# Altium schematic sheet Peripheral-Section.SchDoc
size A4; DocumentNumber: 3; SheetNumber: 3; SheetTotal: 8
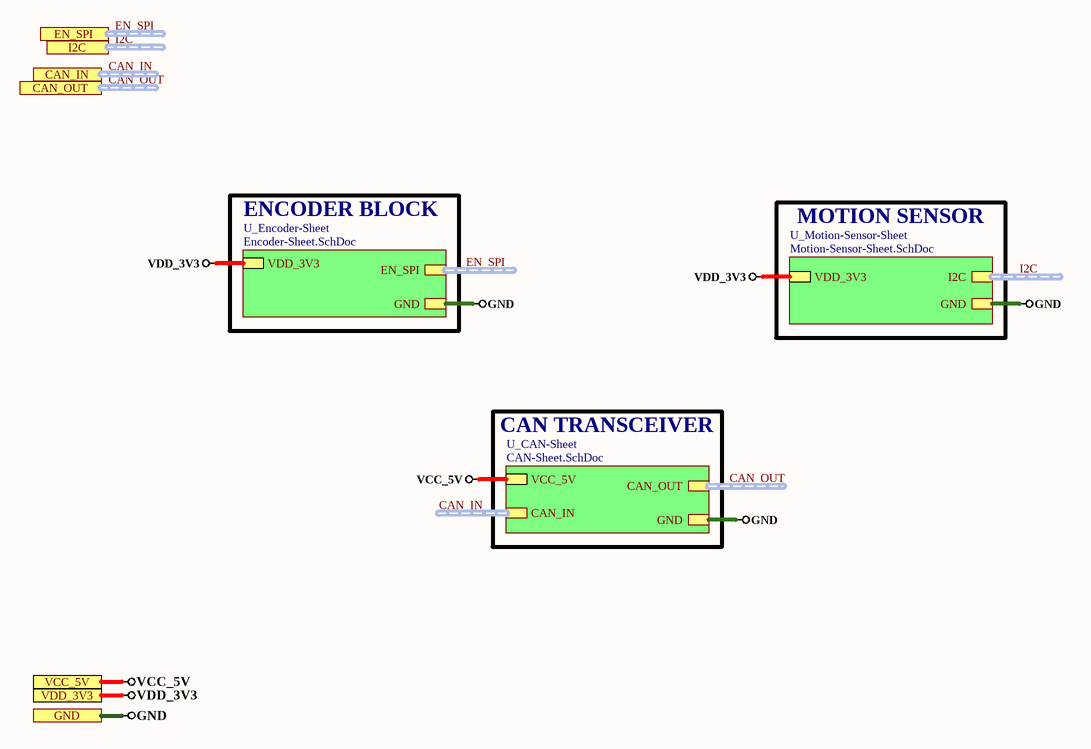
[diagram p0: Peripheral-Section.SchDoc]

## Sub-sheets
U_CAN-Sheet = CAN-Sheet.SchDoc: VCC_5V, GND, CAN_OUT (harness CAN_OUT), CAN_IN (harness CAN_IN)
U_Encoder-Sheet = Encoder-Sheet.SchDoc: EN_SPI (harness EN_SPI), VDD_3V3, GND
U_Motion-Sensor-Sheet = Motion-Sensor-Sheet.SchDoc: VDD_3V3, GND, I2C (harness I2C)

## Ports
CAN_IN (harness CAN_IN), CAN_OUT (harness CAN_OUT), EN_SPI (harness EN_SPI), GND, I2C (harness I2C), VCC_5V, VDD_3V3

## Nets
GND: port GND, sheet U_Encoder-Sheet/GND, sheet U_Motion-Sensor-Sheet/GND, sheet U_CAN-Sheet/GND
VCC_5V: port VCC_5V, sheet U_CAN-Sheet/VCC_5V
VDD_3V3: port VDD_3V3, sheet U_Encoder-Sheet/VDD_3V3, sheet U_Motion-Sensor-Sheet/VDD_3V3

## Buses and harness runs
harness CAN_IN = port CAN_IN
harness CAN_IN = sheet U_CAN-Sheet/CAN_IN
harness CAN_OUT = port CAN_OUT
harness CAN_OUT = sheet U_CAN-Sheet/CAN_OUT
harness EN_SPI = port EN_SPI
harness EN_SPI = sheet U_Encoder-Sheet/EN_SPI
harness I2C = port I2C
harness I2C = sheet U_Motion-Sensor-Sheet/I2C

## Notes on the sheet
- ENCODER BLOCK
- MOTION SENSOR
- CAN TRANSCEIVER